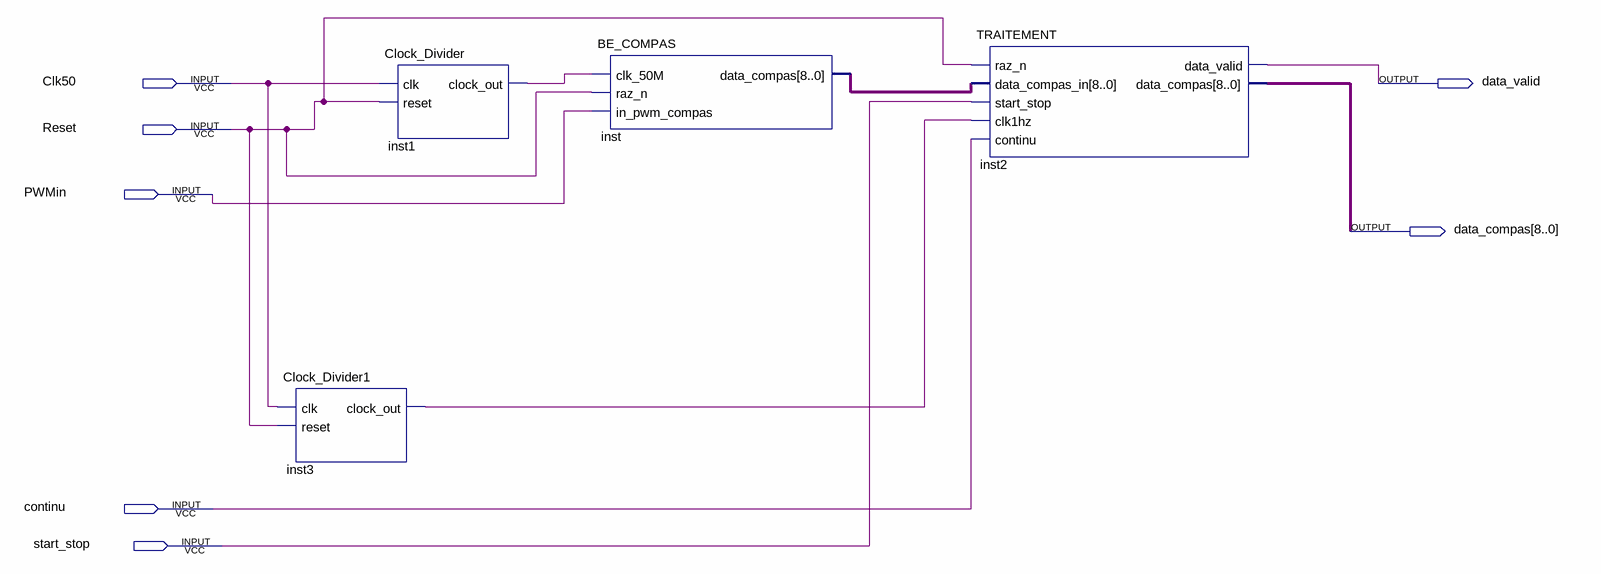
[diagram p0: schematic sheet]
// Quartus schematic Fullcompas.bdf as structural Verilog: 4 symbols, 7 pins
module Fullcompas (
  input  Clk50,
  input  Reset,
  input  PWMin,
  input  continu,
  input  start_stop,
  output data_valid,
  output [8:0] data_compas
);

  wire inst1_clock_out, inst3_clock_out;
  wire [8:0] inst_data_compas;

  Clock_Divider1 inst3 (.clk(Clk50), .reset(Reset), .clock_out(inst3_clock_out));
  Clock_Divider inst1 (.clk(Clk50), .reset(Reset), .clock_out(inst1_clock_out));
  BE_COMPAS inst (.clk_50M(inst1_clock_out), .raz_n(Reset), .in_pwm_compas(PWMin), .data_compas(inst_data_compas));
  TRAITEMENT inst2 (
    .raz_n(Reset), .data_compas_in(inst_data_compas), .start_stop(start_stop), .clk1hz(inst3_clock_out),
    .continu(continu), .data_valid(data_valid), .data_compas(data_compas));
endmodule
